# EAGLE design DSKY (EAGLE 9.6.2)
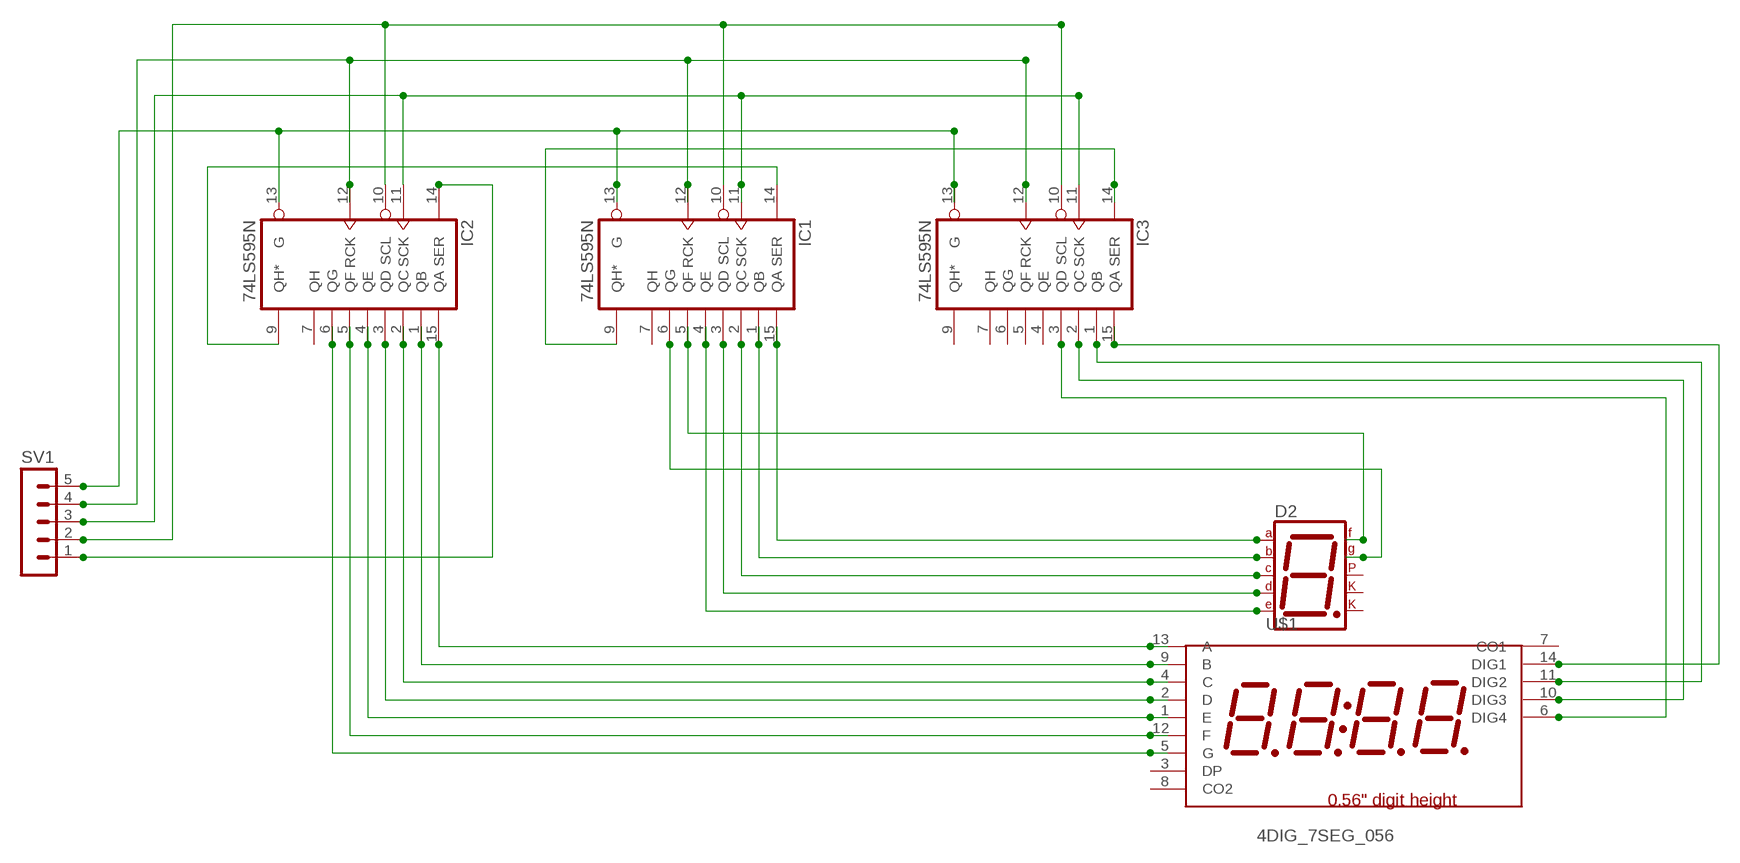
[diagram p0: schematic, sheet 1]

## Parts
D2  7SEG-CK  [7SEG-13]
IC1  74LS595N  [DIL16]
IC2  74LS595N  [DIL16]
IC3  74LS595N  [DIL16]
SV1  MA05-1  [MA05-1]
U$1  4DIG_7SEG_056  [4DIG_7SEG_056]

## Nets
N$1: IC2.15(QA) U$1.13(A)
N$2: IC2.1(QB) U$1.9(B)
N$3: IC2.2(QC) U$1.4(C)
N$4: IC2.3(QD) U$1.2(D)
N$5: IC2.4(QE) U$1.1(E)
N$6: IC2.5(QF) U$1.12(F)
N$7: IC2.6(QG) U$1.5(G)
N$8: D2.7(A) IC1.15(QA)
N$9: D2.6(B) IC1.1(QB)
N$10: D2.4(C) IC1.2(QC)
N$11: D2.2(D) IC1.3(QD)
N$12: D2.1(E) IC1.4(QE)
N$13: D2.9(F) IC1.5(QF)
N$14: D2.10(G) IC1.6(QG)
N$15: IC3.15(QA) U$1.14(DIG1)
N$16: IC3.1(QB) U$1.11(DIG2)
N$17: IC3.2(QC) U$1.10(DIG3)
N$18: IC3.3(QD) U$1.6(DIG4)
N$19: IC1.13(G) IC2.13(G) IC3.13(G) SV1.5
N$20: IC1.14(SER) IC2.9(QH*)
N$21: IC1.9(QH*) IC3.14(SER)
N$22: IC1.12(RCK) IC2.12(RCK) IC3.12(RCK) SV1.4
N$23: IC1.11(SCK) IC2.11(SCK) IC3.11(SCK) SV1.3
N$24: IC1.10(SCL) IC2.10(SCL) IC3.10(SCL) SV1.2
N$25: IC2.14(SER) SV1.1
Unconnected: D2.3(CK1) D2.5(DP) D2.8(CK2) IC1.7(QH) IC2.7(QH) IC3.4(QE) IC3.5(QF) IC3.6(QG) IC3.7(QH) IC3.9(QH*) U$1.3(DP) U$1.7(CO1) U$1.8(CO2)

## Power pins joined to a net without a drawn wire
GND: IC1.8(GND) IC2.8(GND) IC3.8(GND)
VCC: IC1.16(VCC) IC2.16(VCC) IC3.16(VCC)

## Library data of the parts
D2 = special:7SEG-CK: 7-segment DISPLAY single cathode, 13 mm
IC1-IC3 = 74xx-us:74*595: 8-bit SHIFT REGISTER, output latch
SV1 = con-lstb:MA05-1: PIN HEADER; OC_FARNELL: unknown; OC_NEWARK: unknown
U$1 = 7-seg-disp:4DIG_7SEG_056

## Board
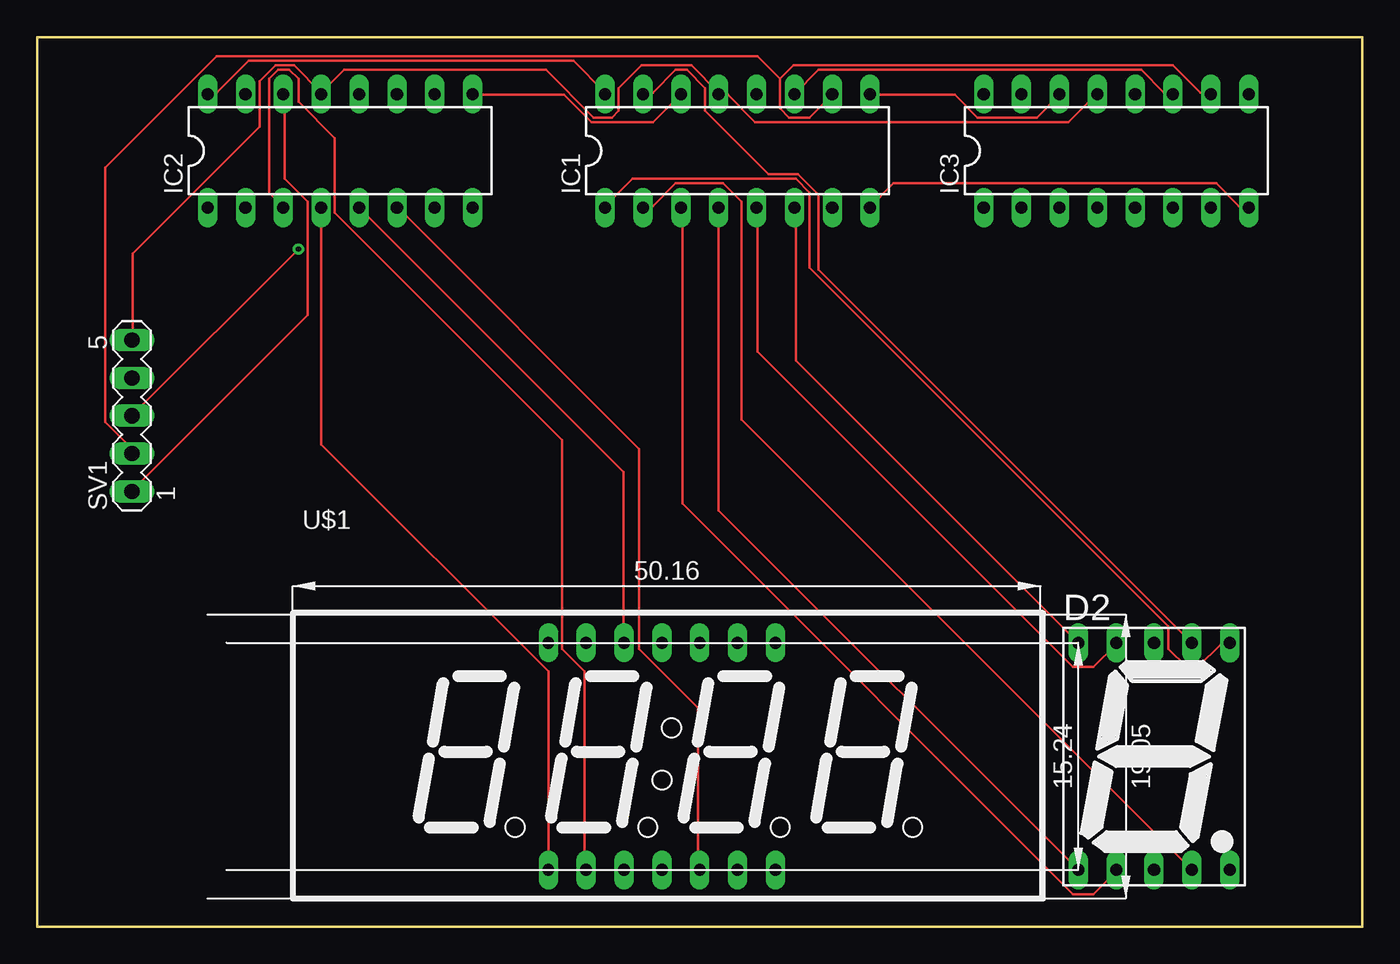
[diagram p1: board, top side]
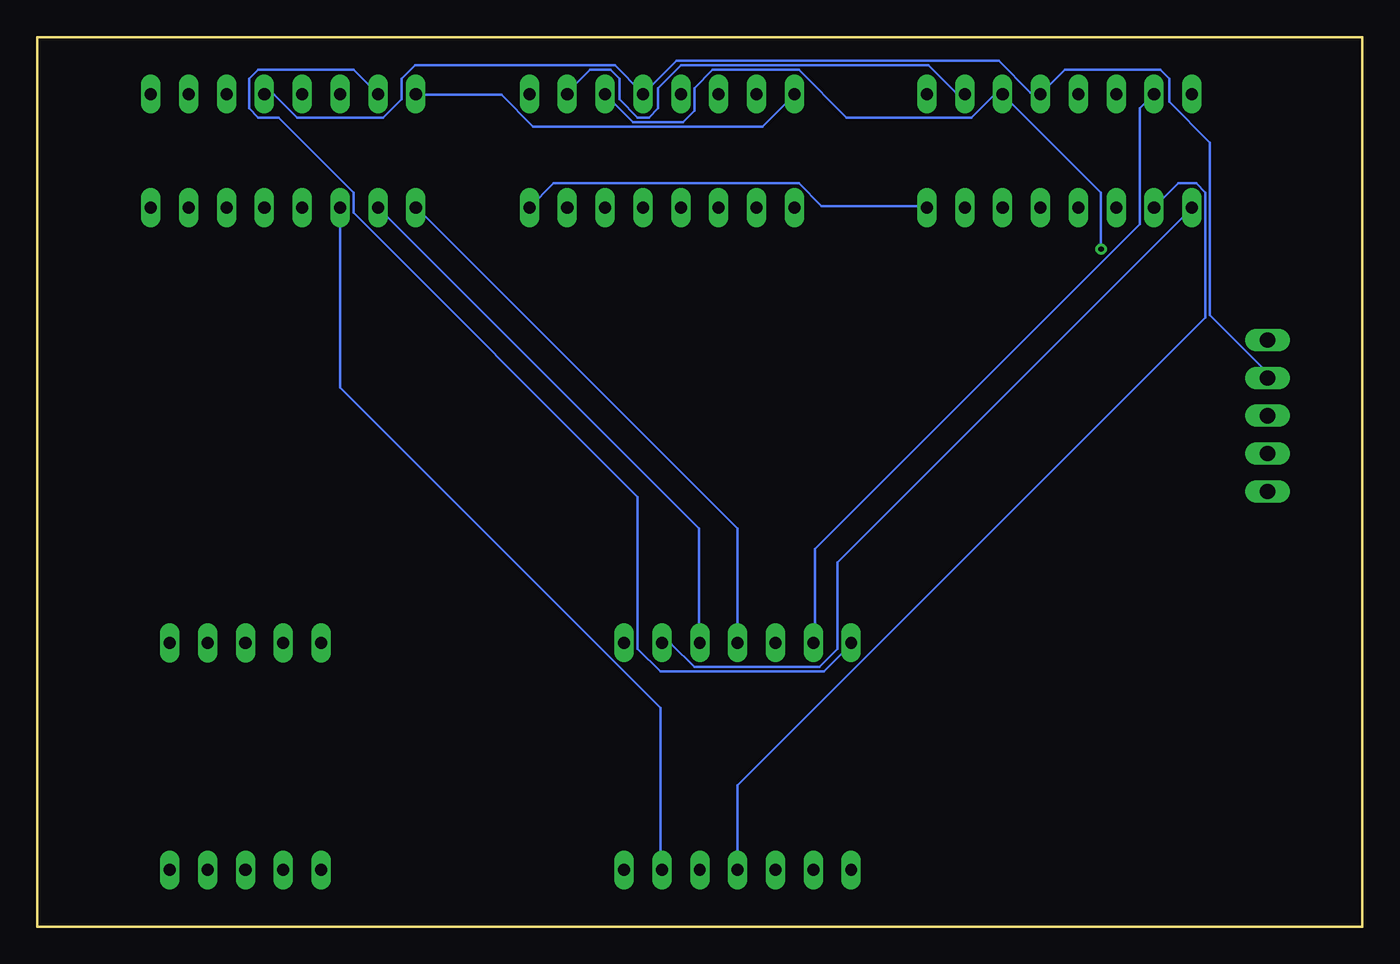
[diagram p2: board, bottom side, seen from below]

Size 88.9 x 59.69 mm. Coordinates in mm from the lower left corner, seen from the top.
Outline: 0,59.69 0,0 88.9,0 88.9,59.69 0,59.69
Copper layers (1*16): Top 0.035mm / dielectric 1.5mm / Bottom 0.035mm
Design rules "default": minimum track width 6mil, minimum drill 0.35mm, track to track 6mil, track to pad 6mil, pad to pad 6mil, via to via 6mil, smd to smd 6mil, copper to edge 40mil, drill to drill 6mil, minimum pad ring 10mil, minimum via ring 8mil, stop-mask expansion 4mil, vias tented up to drill 0mil, thermal gap 10mil

### Footprints (pad centres in the part's own frame; a part is rotated, then mirrored left to right if it is on the bottom)
7SEG-13 = drill 0.813 long: 1 -5.08,-7.62; 2 -2.54,-7.62; 3 0,-7.62; 4 2.54,-7.62; 5 5.08,-7.62; 6 5.08,7.62; 7 2.54,7.62; 8 0,7.62; 9 -2.54,7.62; 10 -5.08,7.62
DIL16 = drill 0.813 long: 1 -8.89,-3.81; 2 -6.35,-3.81; 3 -3.81,-3.81; 4 -1.27,-3.81; 5 1.27,-3.81; 6 3.81,-3.81; 7 6.35,-3.81; 8 8.89,-3.81; 9 8.89,3.81; 10 6.35,3.81; 11 3.81,3.81; 12 1.27,3.81; 13 -1.27,3.81; 14 -3.81,3.81; 15 -6.35,3.81; 16 -8.89,3.81
MA05-1 = drill 1.016 long: 1 -5.08,0; 2 -2.54,0; 3 0,0; 4 2.54,0; 5 5.08,0
4DIG_7SEG_056 = drill 0.8 long: 1 -2.54,-11.43; 2 0,-11.43; 3 2.54,-11.43; 4 5.08,-11.43; 5 7.62,-11.43; 6 10.16,-11.43; 7 12.7,-11.43; 8 12.7,3.81; 9 10.16,3.81; 10 7.62,3.81; 11 5.08,3.81; 12 2.54,3.81; 13 0,3.81; 14 -2.54,3.81

### Placement (x,y rotation side)
D2  74.93,11.43 0 top
IC1  46.99,52.07 0 top
IC2  20.32,52.07 0 top
IC3  72.39,52.07 0 top
SV1  6.35,34.29 90 top
U$1  36.83,15.24 0 top

### Tracks (layer width: path | path; a pad name or v marks a point on that pad's centre or on a via)
GND
  Top 0.152: IC3.8 81.23,48.36 80.62,48.36 79.1,49.89 57.45,49.89 55.93,48.36 IC1.8
  Bottom 0.152: IC1.8 54.25,49.89 37.8,49.89 36.27,48.36 29.26,48.36 IC2.8
N$1
  Bottom 0.152: IC2.15 14.94,54.92 14.94,47.14 36.73,25.35 36.73,19.1 U$1.13
N$2
  Bottom 0.152: U$1.9 46.94,18.95 46.33,18.95 44.81,17.42 36.42,17.42 35.2,18.64 35.2,24.44 11.43,48.21 IC2.1
N$3
  Bottom 0.152: U$1.4 41.91,9.5 10.52,40.89 10.52,49.28 11.12,49.89 12.34,49.89 IC2.2
N$4
  Top 0.152: U$1.2 36.73,3.86 36.73,17.12 35.2,18.64 35.2,32.66 19.96,47.9 19.96,52.93 17.53,55.37 17.53,56.9 16.92,57.51 16.15,57.51 15.54,56.9 15.54,49.28 16.46,48.36 IC2.3
N$5
  Top 0.152: U$1.1 34.29,17.12 19.05,32.36 IC2.4
N$6
  Top 0.152: IC2.5 39.32,30.53 39.32,19.1 U$1.12
N$7
  Top 0.152: U$1.5 44.35,3.86 44.35,14.68 40.39,18.64 40.39,32.05 24.23,48.21 IC2.6
N$8
  Top 0.152: D2.7 52.43,44.09 52.43,49.12 51.05,50.5 49.07,50.5 44.81,54.76 44.81,56.29 43.59,57.51 42.82,57.51 41.3,55.98 40.69,55.98 IC1.15
N$9
  Top 0.152: D2.6 80.01,18.95 79.4,18.95 77.88,17.42 77.11,17.42 75.89,18.64 75.89,20.17 51.82,44.25 51.82,49.28 50.9,50.19 39.93,50.19 38.1,48.36 IC1.1
N$10
  Top 0.152: D2.4 47.24,34.04 47.24,48.67 46.02,49.89 42.82,49.89 41.3,48.36 40.69,48.36 IC1.2
N$11
  Top 0.152: IC1.3 43.28,48.21 43.28,28.4 69.49,2.18 70.87,2.18 72.39,3.71 D2.2
N$12
  Top 0.152: IC1.4 45.72,27.94 D2.1
N$13
  Top 0.152: IC1.5 48.31,48.21 48.31,38.61 69.49,17.42 70.87,17.42 72.39,18.95 D2.9
N$14
  Top 0.152: D2.10 50.9,38 50.9,48.21 IC1.6
N$15
  Bottom 0.152: IC3.15 67.67,57.51 74.07,57.51 74.68,56.9 74.68,54.92 74.07,54.31 72.69,54.31 67.67,49.28 67.67,47.9 48.62,28.85 48.62,18.64 47.09,17.12 36.12,17.12 34.29,18.95 U$1.14
N$16
  Bottom 0.152: U$1.11 41.91,26.72 63.4,48.21 IC3.1
N$17
  Bottom 0.152: IC3.2 44.5,26.72 44.5,19.1 U$1.10
N$18
  Bottom 0.152: IC3.3 68.58,36.17 47.09,14.68 47.09,3.86 U$1.6
N$19
  Top 0.152: IC3.13 71.02,55.83 69.19,54 48.16,54 46.33,55.83 45.72,55.83 IC1.13 45.72,55.98 43.89,57.81 40.54,57.81 39.01,56.29 39.01,54.76 38.56,54.31 37.34,54.31 34.14,57.51 20.57,57.51 19.05,55.98 | 19.05,55.98 17.22,57.81 16,57.81 14.94,56.74 14.94,53.7 6.4,45.16 6.4,39.37 SV1.5 | 19.05,55.98 IC2.13
N$20
  Top 0.152: IC1.14 41.3,54 37.19,54 35.36,55.83 29.26,55.83 IC2.9
N$21
  Top 0.152: IC1.9 55.93,55.83 61.57,55.83 63.09,54.31 67.06,54.31 68.58,55.83 IC3.14
N$22
  Bottom 0.152: IC3.12 73.61,55.83 73,55.83 71.48,54.31 65.68,54.31 64.47,55.52 64.47,56.9 63.55,57.81 50.14,57.81 48.31,55.98 IC1.12 46.02,58.11 24.38,58.11 22.25,55.98 21.64,55.98 IC2.12 19.96,57.51 13.56,57.51 12.95,56.9 12.95,55.37 10.21,52.63 10.21,41.05 6.4,37.24 6.4,36.93 SV1.4
N$23  (via drill 0.35)
  Top 0.152: IC1.11 52.43,57.51 74.07,57.51 75.59,55.98 76.2,55.98 IC3.11 | v17.53,45.47 SV1.3
  Bottom 0.152: IC1.11 48.92,54 45.57,54 44.81,54.76 44.81,56.29 43.59,57.51 37.8,57.51 34.59,54.31 26.21,54.31 24.69,55.83 24.23,55.83 IC2.11 17.53,49.28 v17.53,45.47
N$24
  Top 0.152: 49.84,56.9 50.75,57.81 76.2,57.81 78.03,55.98 78.64,55.98 IC3.10 | 49.84,56.9 49.84,54.92 50.44,54.31 51.82,54.31 53.34,55.83 IC1.10 | 49.84,56.9 48.31,58.42 12.04,58.42 4.57,50.95 4.57,33.88 6.25,32.21 6.25,31.75 SV1.2
  Bottom 0.152: IC2.10 26.67,55.98 27.28,55.98 29.11,57.81 45.72,57.81 47.24,56.29 47.24,54.92 47.85,54.31 48.62,54.31 49.84,55.52 49.84,56.9 50.44,57.51 51.82,57.51 53.34,55.98 IC1.10
N$25
  Top 0.152: IC2.14 16.61,55.83 16.61,50.19 18.14,48.67 18.14,41.05 6.4,29.31 SV1.1
VCC
  Top 0.152: IC2.16 11.43,55.98 12.04,55.98 14.17,58.11 35.97,58.11 38.1,55.98 IC1.16
  Bottom 0.152: IC3.16 63.4,55.83 57.76,55.83 55.63,53.7 40.23,53.7 38.1,55.83 IC1.16